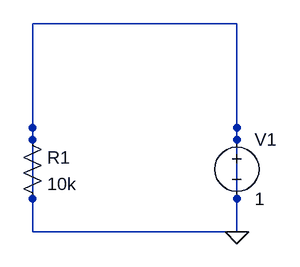
[diagram p0: schematic net0.asc]
net0.asc, the LTspice schematic file:
Version 4
SHEET 1 680 480
SYMBOL voltage 534 399 R0
SYMATTR InstName V1
SYMATTR Value 1
FLAG 534 540 0
SYMBOL res 242 399 R0
SYMATTR InstName R1
SYMATTR Value 10k
WIRE 534 540 534 399
WIRE 258 415 258 258
WIRE 534 258 534 415
WIRE 534 258 258 258
WIRE 258 540 534 540
WIRE 258 540 258 399

The netlist it stands for:
* net0.asc
V1 0 0 1
R1 0 0 10k
.backanno
.end